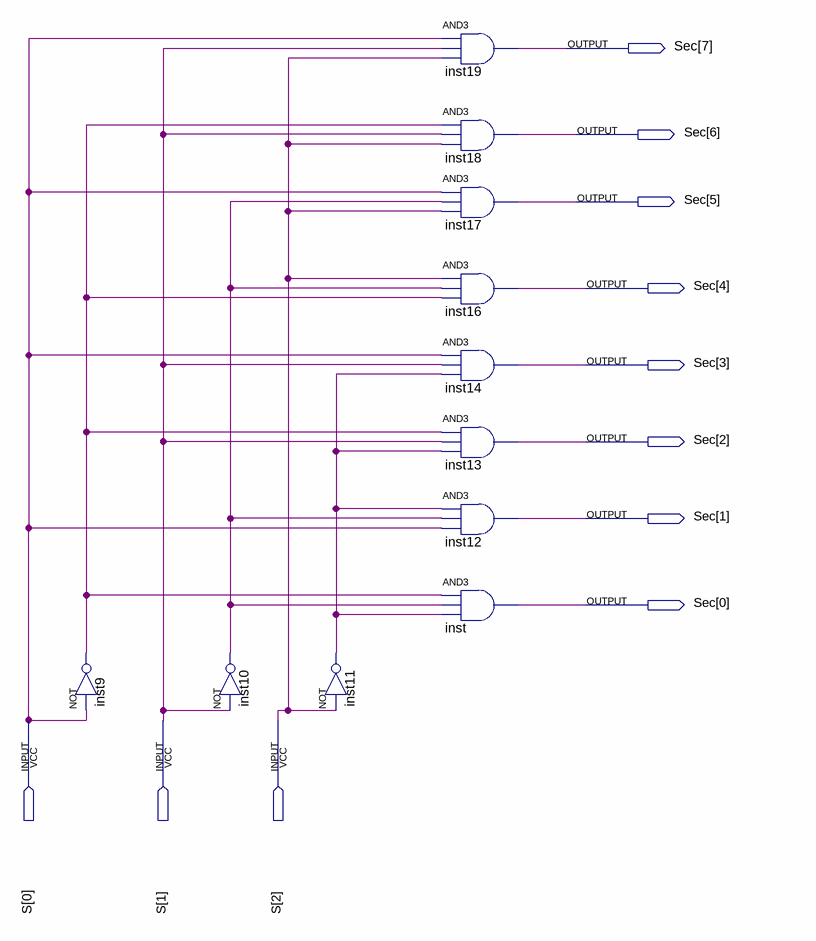
[diagram p0: schematic sheet]
// Quartus schematic Selector.bdf as structural Verilog: 11 symbols, 11 pins
module Selector (
  input  [2:0] S,
  output [7:0] Sec
);

  wire inst9_out, inst10_out, inst11_out;

  not inst9 (inst9_out, S[0]);
  not inst10 (inst10_out, S[1]);
  not inst11 (inst11_out, S[2]);
  and inst19 (Sec[7], S[0], S[1], S[2]);
  and inst18 (Sec[6], inst9_out, S[1], S[2]);
  and inst17 (Sec[5], S[0], inst10_out, S[2]);
  and inst16 (Sec[4], S[2], inst10_out, inst9_out);
  and inst14 (Sec[3], S[0], S[1], inst11_out);
  and inst13 (Sec[2], inst9_out, S[1], inst11_out);
  and inst12 (Sec[1], inst11_out, inst10_out, S[0]);
  and inst (Sec[0], inst9_out, inst10_out, inst11_out);
endmodule
